# EasyEDA Pro project OPA847.eprj

# Schematic Schematic1
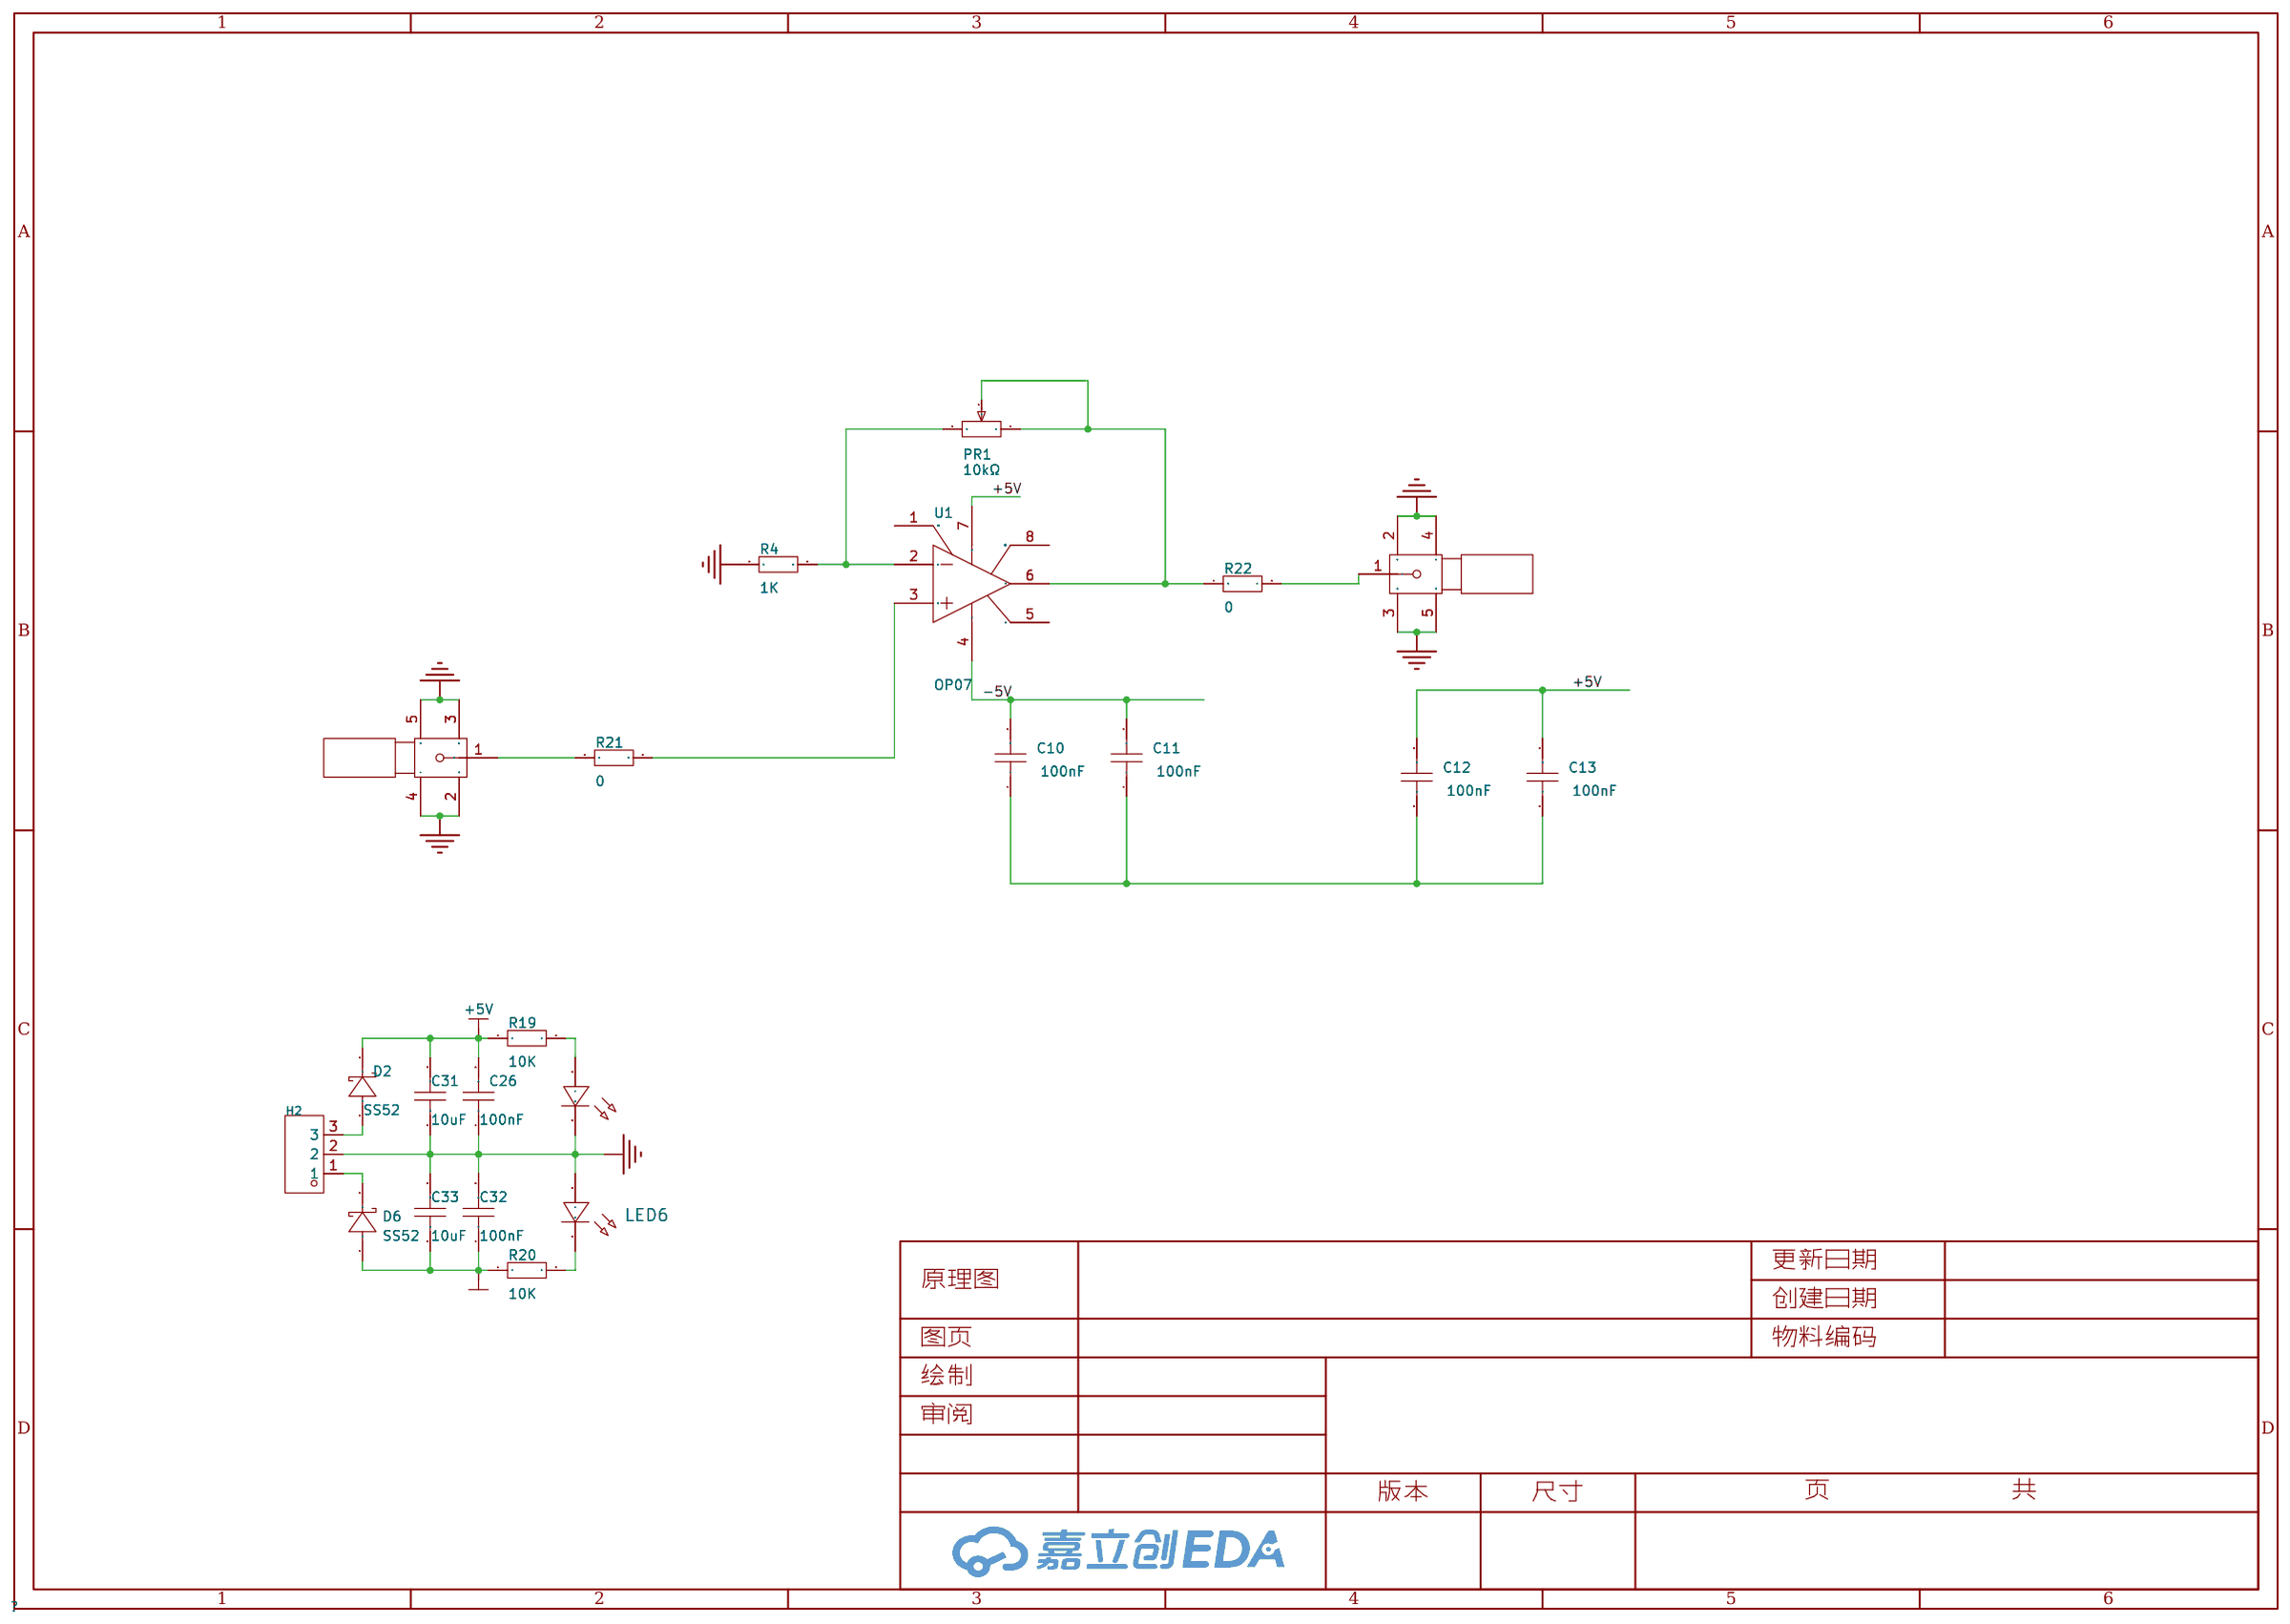
[diagram p0: schematic sheet]

## Parts
C10  100nF  [C0603]
C11  100nF  [C0603]
C12  100nF  [C0603]
C13  100nF  [C0603]
C26  100nF  [C0603]
C31  10uF  [C0603]
C32  100nF  [C0603]
C33  10uF  [C0603]
D2  SS52  [SMA_L4.3-W2.6-LS5.1-R-RD]
D6  SS52  [SMA_L4.3-W2.6-LS5.1-R-RD]
H2  -  [HDR-TH_3P-P2.54-V-F]
IN2  IN  [SMA-SMD_SMA-KE]
IN3  IN  [SMA-SMD_SMA-KE]
LED3  -  [LED_0603]
LED6  -  [LED_0603]
PR1  10kΩ  [R_3296]
R4  1K  [R0603]
R19  10K  [R0603]
R20  10K  [R0603]
R21  0  [R0603]
R22  0  [R0603]
U1  OP07  [SOP-8_L4.9-W3.9-P1.27-LS6.0-BL]

## Library data of the parts
C10-C13 C26 C31-C33 = CAP_0603: Supplier Footprint: 0603
D2 D6 = SS52: 二极管配置:独立式;正向压降(Vf):550mV@5A;直流反向耐压(Vr):20V;平均整流电流(Io):5A;; LCSC Part Name: 电压:20V 电流:5A; Supplier Part: C727064; Manufacturer: TWGMC(台湾迪嘉); Supplier Footprint: SMA(DO-214AC); JLCPCB Part Class: 扩展库; Datasheet: https://atta.szlcsc.com/upload/public/pdf/source/20200828/C727064_BD0A2B36CBC76CEA4B6710C57718D41F.pdf; Supplier: LCSC; Diode Configuration: 独立式; Forward Voltage (Vf@If): 550mV@5A; Reverse Voltage (Vr): 20V; Average Rectified Current (Io): 5A; Reverse Leakage Current (Ir): 500uA@20V
H2 = HDR-F_2.54_1x3P: Supplier Part: C541850; Supplier Footprint: 插件; Supplier: LCSC; Manufacturer: XFCN(兴飞); Manufacturer Part: PM254V-11-03-H85; JLCPCB Part Class: 扩展库
IN2 IN3 = SMA-KE_C9900004802: LCSC Part Name: SMA-KE; Supplier Part: C9900004802; Supplier Footprint: SMA-Hole-2Pin; JLCPCB Part Class: 扩展库; Supplier: LCSC
LED3 LED6 = LED_0603-R: Supplier Footprint: 0603
PR1 = R_3296: Supplier Footprint: 直插
R4 R19-R22 = Res_0603: Supplier Footprint: 0603
U1 = OP07: 放大器组数:-;; Supplier Part: C1508997; Manufacturer: 杭州瑞盟; Supplier Footprint: SOP-8; JLCPCB Part Class: 扩展库; Datasheet: https://atta.szlcsc.com/upload/public/pdf/source/20201221/C1508997_31DB1D3DFE7BEFB064DC1C62AA82E0AA.pdf; Supplier: LCSC

## Nets
+5V: C12.2 C13.2 C26.2 C31.2 D2.2(K) R19.1 U1.7(V+)
-5V: C10.2 C11.2 C32.1 C33.1 D6.1(A) R20.1 U1.4(V-)
GND: C10.1 C11.1 C12.1 C13.1 C26.1 C31.1 C32.2 C33.2 H2.2 IN2.2 IN2.3 IN2.4 IN2.5 IN3.2 IN3.3 IN3.4 IN3.5 LED3.1(C) LED6.2(A) R4.1
$1N559: R21.2 U1.3(IN+)
$1N560: IN2.1 R21.1
$1N564: PR1.3 R4.2 U1.2(IN-)
$1N1121: LED6.1(C) R20.2
$1N1122: D2.1(A) H2.3
$1N1124: D6.2(K) H2.1
$1N1126: LED3.2(A) R19.2
$1N1210: IN3.1 R22.2
$1N1216: PR1.1 PR1.2 R22.1 U1.6(OUT)

Not connected (* = marked no-connect by the designer): U1 1(VOS TRIM) 5(NC) 8(VOS TRIM)

# Board PCB1
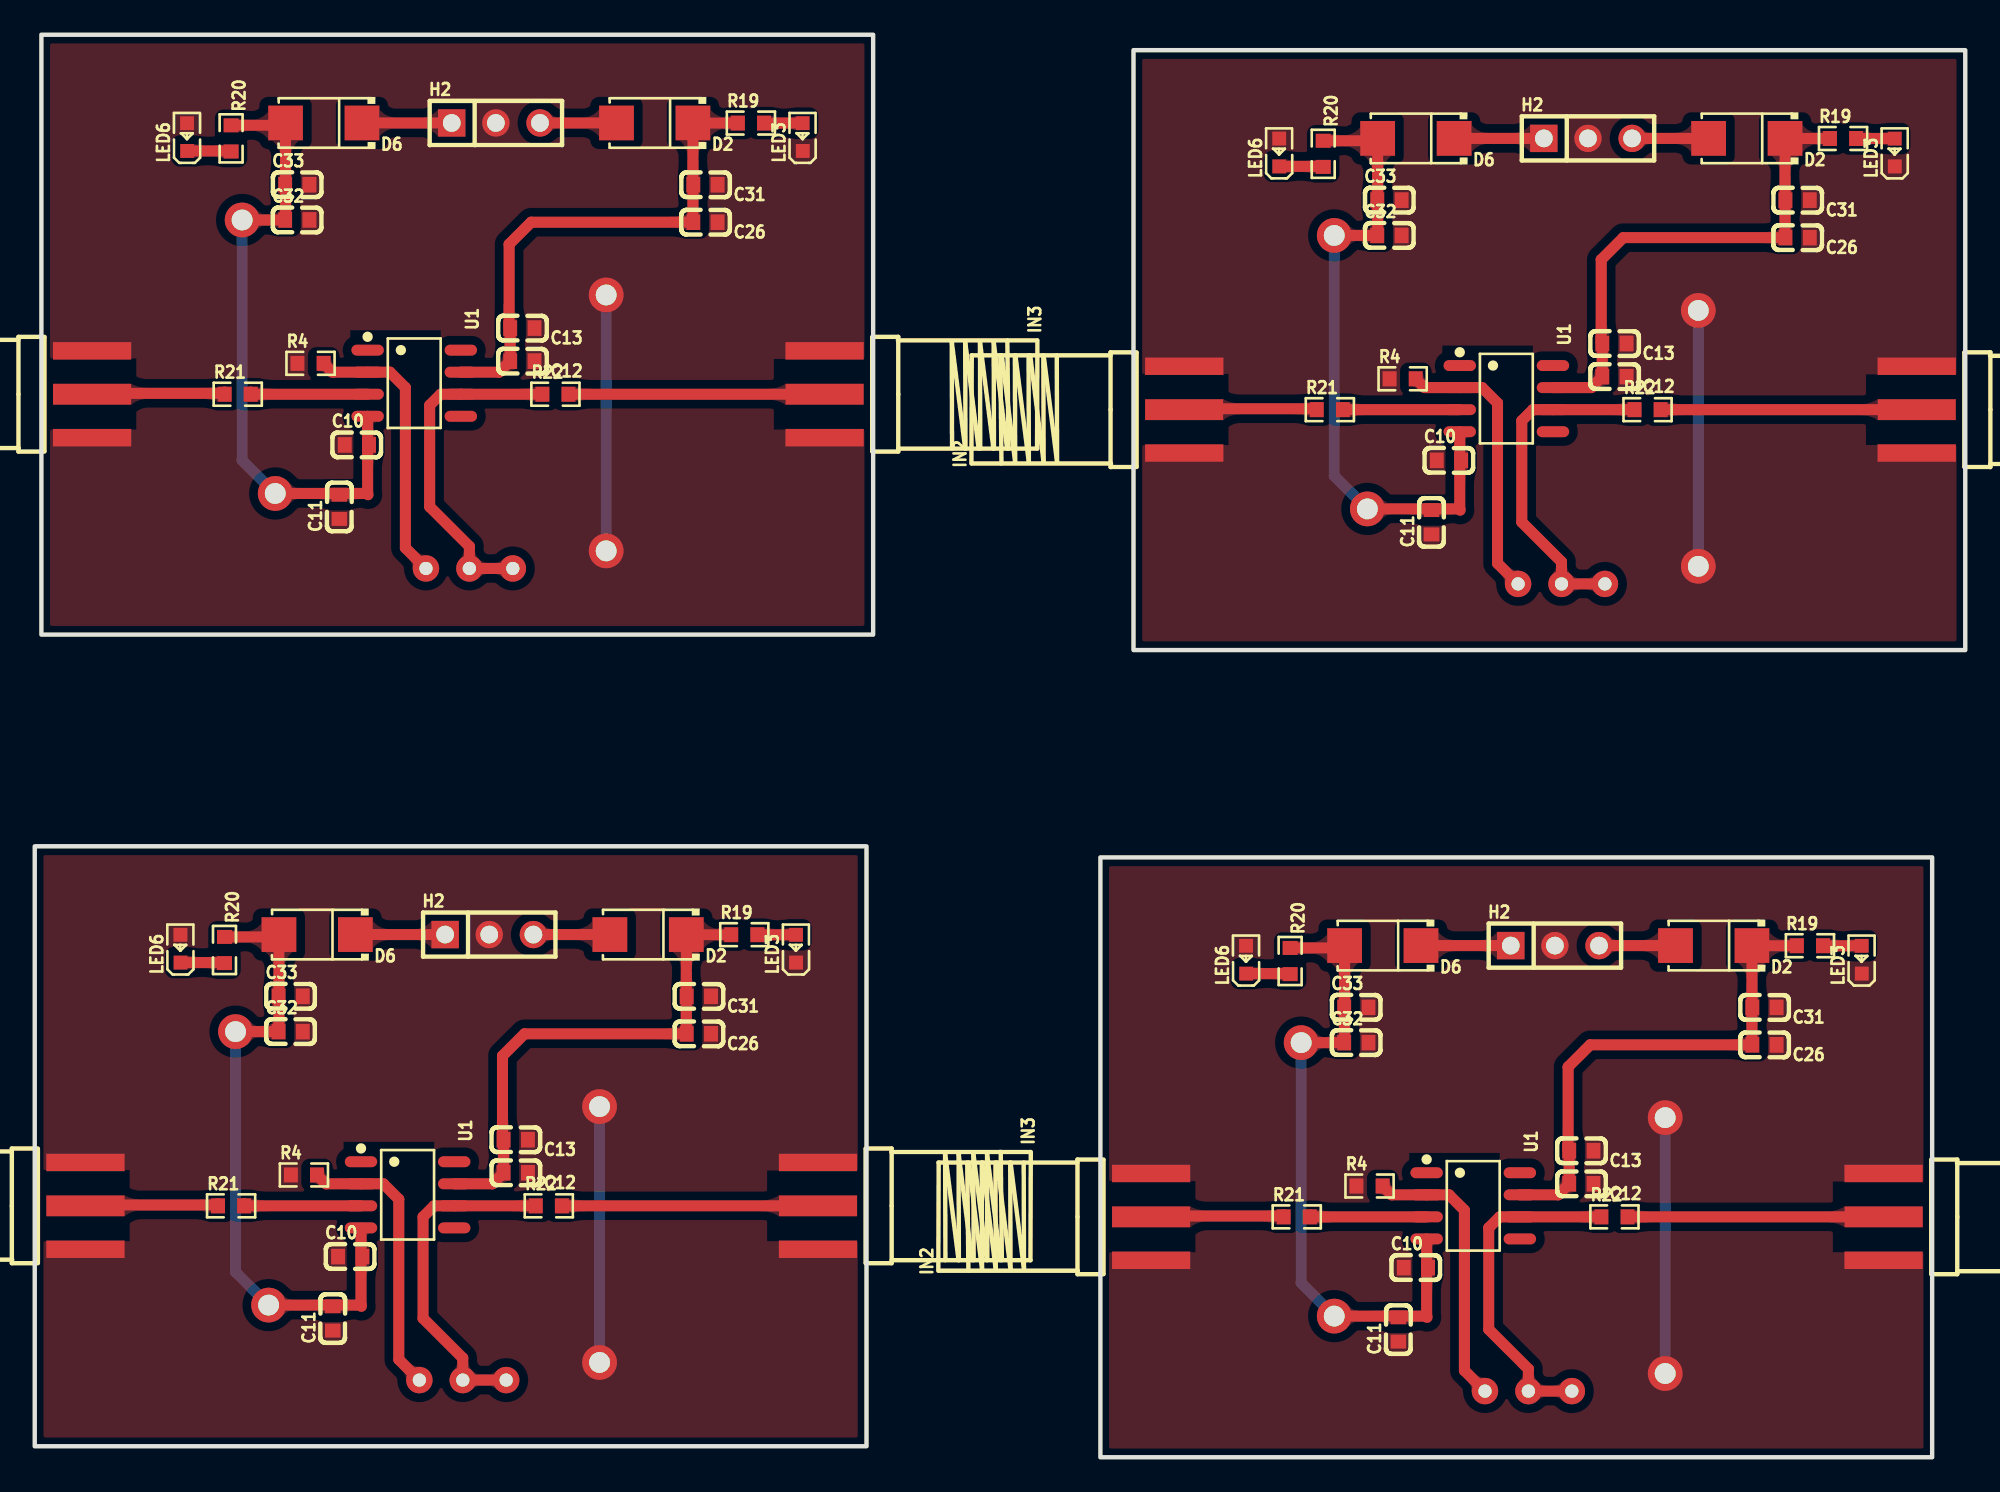
[diagram p1: board, top side]
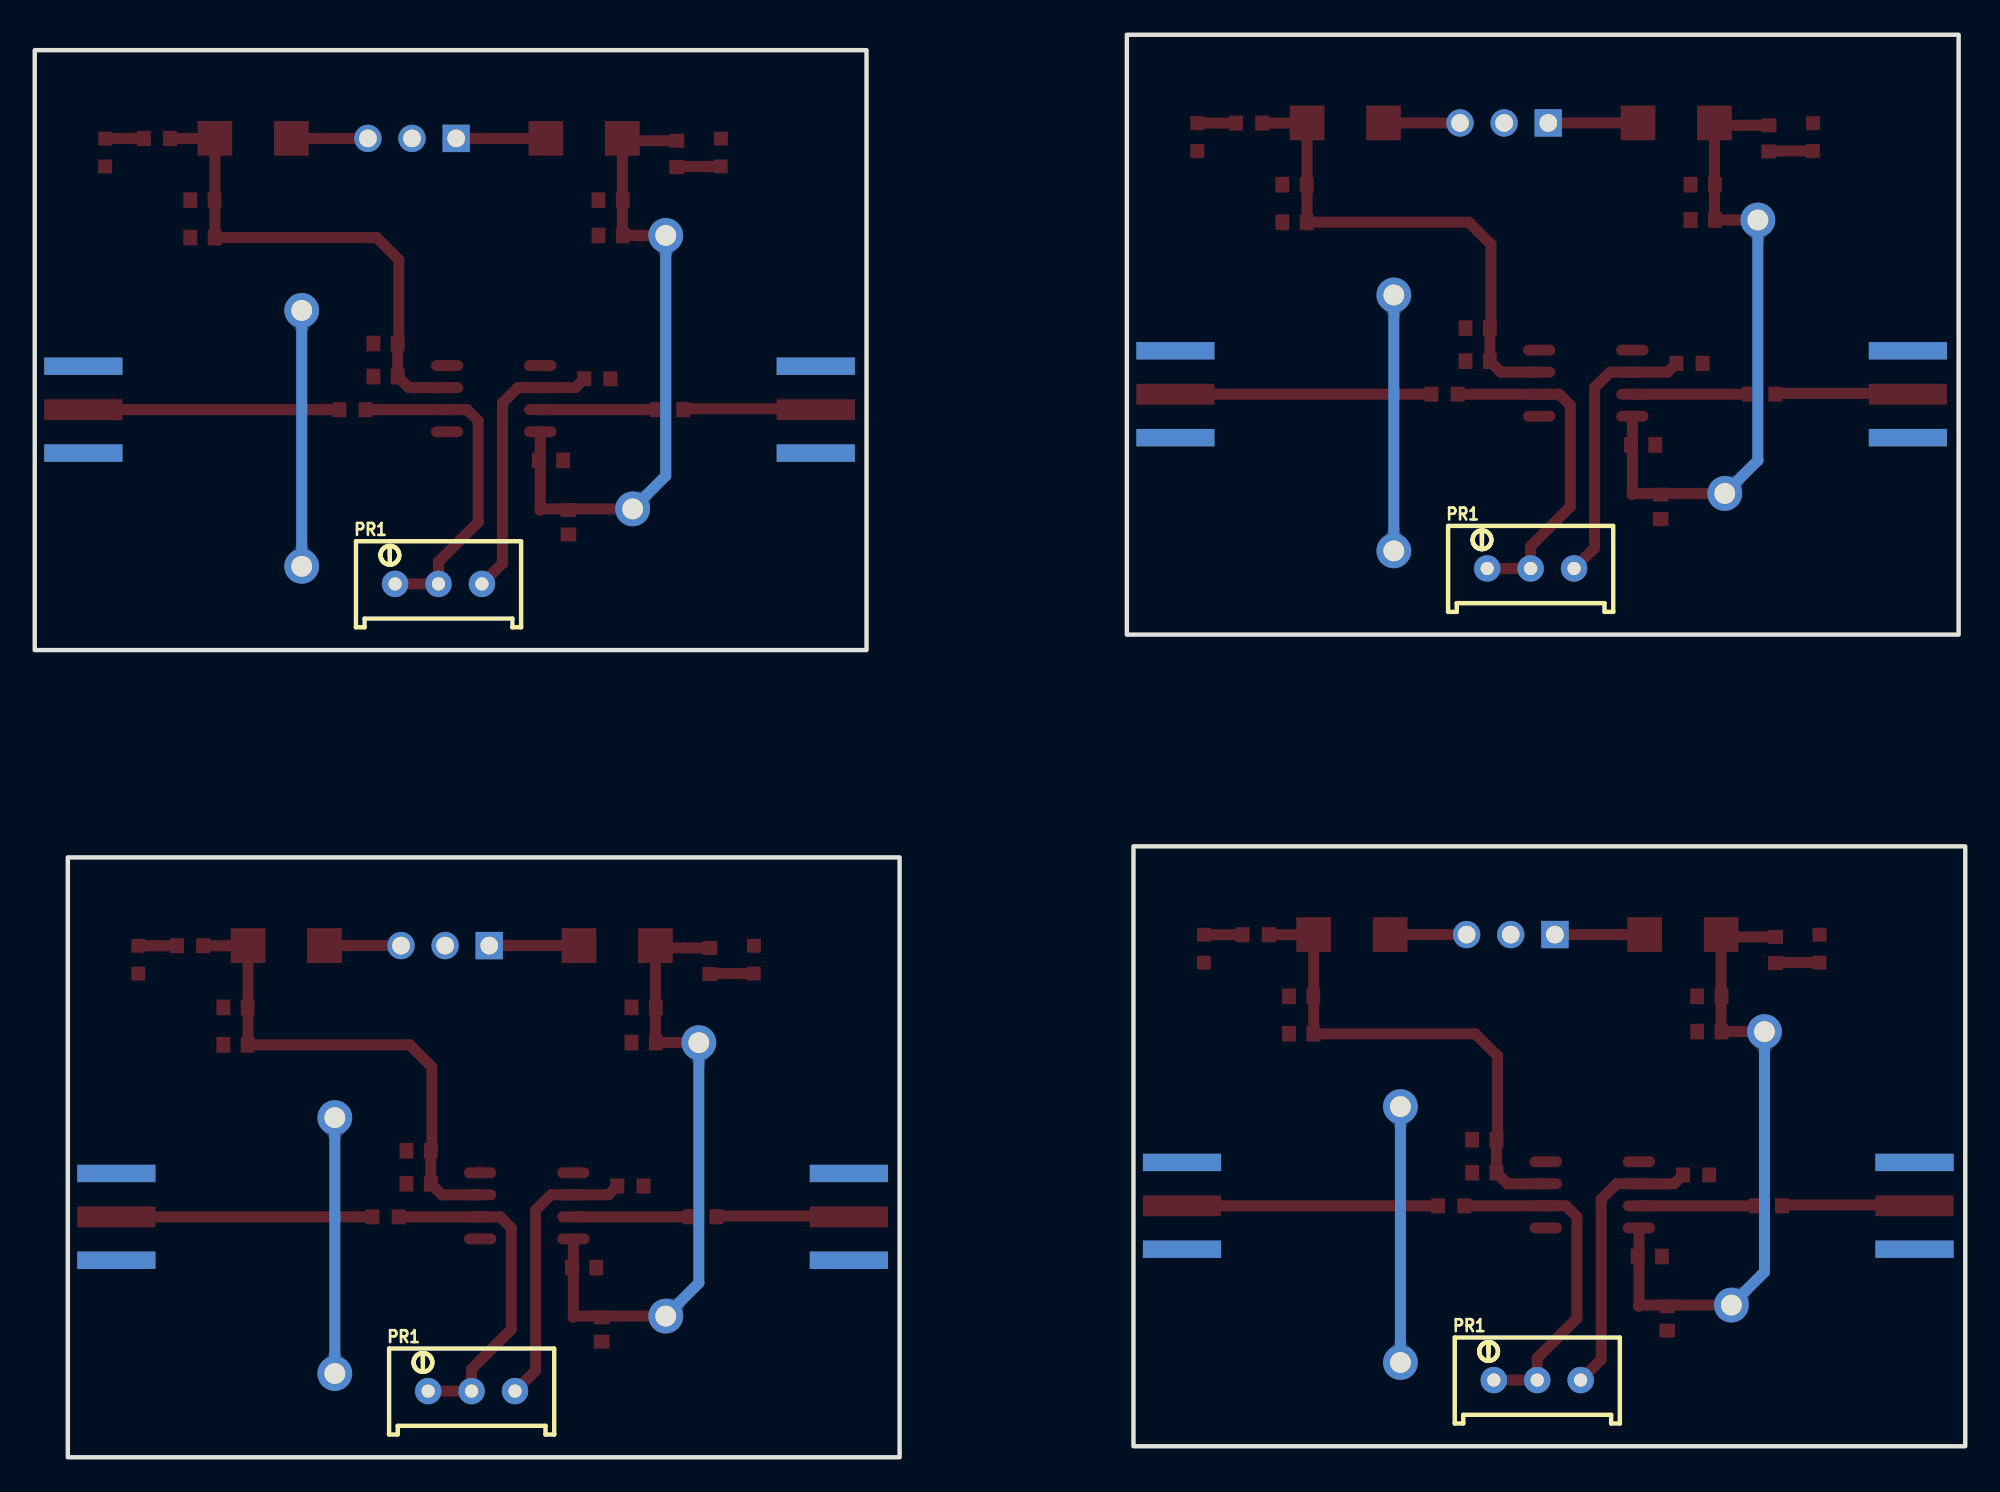
[diagram p2: board, bottom side, seen from below]

Outline 111.12 x 81.91 mm; copper layers: Top Layer, Bottom Layer. Coordinates in mm from the lower left corner of the outline.
Outline path: rectangle 0,35.18 47.88,0.63 ; rectangle 0.38,81.91 48.26,47.37 ; rectangle 61.34,34.54 109.22,0 ; rectangle 63.25,81.03 111.12,46.48
Stack: Top Layer 0.035mm / Dielectric1 1.51mm FR4 er 4.5 / Bottom Layer 0.035mm

## Design rules (mm)
template: 自定义配置
spacing copperThickness1oz (default): track to track 0.102, other pairs 0.152 to 0.3
spacing copperThickness2oz: track to track 0.203, other pairs 0.152 to 0.3
track width copperThickness1oz (default): min 0.127, default 0.254, max 2.54
track width copperThickness2oz: min 0.203, default 0.254, max 2.54
differential pair differentialPair (default): width min 0.127, default 0.254, max 2.54; gap min 0.152, default 0.152
via viaSize (default): diameter min 0.5, default 0.61, max 10; hole min 0.3, default 0.305, max 6.3

## Placement (name value [footprint] x y rotation side)
C10  100nF  [C0603]  81.41 57.4 0 top
C10#2  -  [C0603]  18.54 58.29 0 top
C10#3  -  [C0603]  18.16 11.56 0 top
C10#4  -  [C0603]  79.5 10.92 0 top
C11  100nF  [C0603]  17.54 54.73 90 top
C11#2  -  [C0603]  17.15 7.99 90 top
C11#3  -  [C0603]  80.4 53.84 90 top
C11#4  -  [C0603]  78.5 7.36 90 top
C12  100nF  [C0603]  28.07 63.12 180 top
C12#2  -  [C0603]  27.69 16.38 180 top
C12#3  -  [C0603]  90.93 62.23 180 top
C12#4  -  [C0603]  89.03 15.75 180 top
C13  100nF  [C0603]  28.07 65.02 180 top
C13#2  -  [C0603]  27.69 18.29 180 top
C13#3  -  [C0603]  90.93 64.13 180 top
C13#4  -  [C0603]  89.03 17.65 180 top
C26  100nF  [C0603]  38.23 24.38 180 top
C26#2  -  [C0603]  38.61 71.12 180 top
C26#3  -  [C0603]  101.47 70.23 180 top
C26#4  -  [C0603]  99.57 23.75 180 top
C31  10uF  [C0603]  38.23 26.54 180 top
C31#2  -  [C0603]  101.47 72.39 180 top
C31#3  -  [C0603]  99.57 25.91 180 top
C31#4  -  [C0603]  38.61 73.28 180 top
C32  100nF  [C0603]  14.73 24.51 0 top
C32#2  -  [C0603]  77.98 70.36 0 top
C32#3  -  [C0603]  76.07 23.88 0 top
C32#4  -  [C0603]  15.11 71.25 0 top
C33  10uF  [C0603]  14.73 26.54 0 top
C33#2  -  [C0603]  77.98 72.39 0 top
C33#3  -  [C0603]  76.07 25.91 0 top
C33#4  -  [C0603]  15.11 73.28 0 top
D2  SS52  [SMA_L4.3-W2.6-LS5.1-R-RD]  35.31 30.1 180 top
D2#2  -  [SMA_L4.3-W2.6-LS5.1-R-RD]  98.55 75.95 180 top
D2#3  -  [SMA_L4.3-W2.6-LS5.1-R-RD]  96.65 29.46 180 top
D2#4  -  [SMA_L4.3-W2.6-LS5.1-R-RD]  35.69 76.83 180 top
D6  SS52  [SMA_L4.3-W2.6-LS5.1-R-RD]  16.64 76.83 180 top
D6#2  -  [SMA_L4.3-W2.6-LS5.1-R-RD]  16.26 30.1 180 top
D6#3  -  [SMA_L4.3-W2.6-LS5.1-R-RD]  79.5 75.95 180 top
D6#4  -  [SMA_L4.3-W2.6-LS5.1-R-RD]  77.6 29.46 180 top
H2  -  [HDR-TH_3P-P2.54-V-F]  26.54 76.83 0 top
H2#2  -  [HDR-TH_3P-P2.54-V-F]  26.16 30.1 0 top
H2#3  -  [HDR-TH_3P-P2.54-V-F]  89.41 75.95 0 top
H2#4  -  [HDR-TH_3P-P2.54-V-F]  87.5 29.46 0 top
IN2  IN  [SMA-SMD_SMA-KE]  3.3 61.21 90 top
IN2#2  -  [SMA-SMD_SMA-KE]  2.92 14.48 90 top
IN2#3  -  [SMA-SMD_SMA-KE]  66.17 60.32 90 top
IN2#4  -  [SMA-SMD_SMA-KE]  64.26 13.84 90 top
IN3  IN  [SMA-SMD_SMA-KE]  45.47 61.21 270 top
IN3#2  -  [SMA-SMD_SMA-KE]  45.09 14.48 270 top
IN3#3  -  [SMA-SMD_SMA-KE]  108.33 60.32 270 top
IN3#4  -  [SMA-SMD_SMA-KE]  106.43 13.84 270 top
LED3  -  [LED_0603]  44.2 76.07 90 top
LED3#2  -  [LED_0603]  43.81 29.34 90 top
LED3#3  -  [LED_0603]  107.06 75.18 90 top
LED3#4  -  [LED_0603]  105.16 28.7 90 top
LED6  -  [LED_0603]  71.63 75.18 90 top
LED6#2  -  [LED_0603]  8.76 76.07 90 top
LED6#3  -  [LED_0603]  8.38 29.34 90 top
LED6#4  -  [LED_0603]  69.72 28.7 90 top
NOREF  -  [Pad_e502]  95.76 66.04 0 top
NOREF#2  -  [Pad_e577]  72.9 23.88 0 top
NOREF#3  -  [Pad_e579]  93.85 4.82 0 top
NOREF#4  -  [Pad_e499]  74.8 70.36 0 top
NOREF#5  -  [Pad_e197]  32.89 52.19 0 top
NOREF#6  -  [Pad_e580]  93.85 19.56 0 top
NOREF#7  -  [Pad_e501]  95.76 51.3 0 top
NOREF#8  -  [Pad_e196]  32.89 66.93 0 top
NOREF#9  -  [Pad_e500]  76.71 54.61 0 top
NOREF#10  -  [Pad_e423]  32.51 5.46 0 top
NOREF#11  -  [Pad_e91]  11.94 71.25 0 top
NOREF#12  -  [Pad_e578]  74.8 8.13 0 top
NOREF#13  -  [Pad_e421]  11.56 24.51 0 top
NOREF#14  -  [Pad_e424]  32.51 20.19 0 top
NOREF#15  -  [Pad_e422]  13.46 8.76 0 top
NOREF#16  -  [Pad_e102]  13.84 55.5 0 top
PR1  10kΩ  [R_3296]  25.02 51.31 180 bottom
PR1#2  -  [R_3296]  24.64 4.57 180 bottom
PR1#3  -  [R_3296]  87.88 50.42 180 bottom
PR1#4  -  [R_3296]  85.98 3.94 180 bottom
R4  1K  [R0603]  15.88 62.99 0 top
R4#2  -  [R0603]  15.49 16.26 0 top
R4#3  -  [R0603]  78.74 62.1 0 top
R4#4  -  [R0603]  76.84 15.62 0 top
R19  10K  [R0603]  41.22 76.83 0 top
R19#2  -  [R0603]  40.84 30.09 0 top
R19#3  -  [R0603]  104.09 75.94 0 top
R19#4  -  [R0603]  102.19 29.46 0 top
R20  10K  [R0603]  11.3 75.95 270 top
R20#2  -  [R0603]  10.92 29.21 270 top
R20#3  -  [R0603]  74.17 75.06 270 top
R20#4  -  [R0603]  72.26 28.57 270 top
R21  0  [R0603]  11.68 61.21 0 top
R21#2  -  [R0603]  11.3 14.48 0 top
R21#3  -  [R0603]  74.55 60.32 0 top
R21#4  -  [R0603]  72.64 13.84 0 top
R22  0  [R0603]  29.97 61.21 0 top
R22#2  -  [R0603]  29.59 14.48 0 top
R22#3  -  [R0603]  92.84 60.32 0 top
R22#4  -  [R0603]  90.93 13.84 0 top
U1  OP07  [SOP-8_L4.9-W3.9-P1.27-LS6.0-BL]  21.84 61.85 270 top
U1#2  -  [SOP-8_L4.9-W3.9-P1.27-LS6.0-BL]  21.46 15.11 270 top
U1#3  -  [SOP-8_L4.9-W3.9-P1.27-LS6.0-BL]  84.71 60.96 270 top
U1#4  -  [SOP-8_L4.9-W3.9-P1.27-LS6.0-BL]  82.8 14.48 270 top

## Footprints (pads in the part's own frame, mm; a bottom-side part is the same pattern mirrored in y, then rotated)
C0603
  rect 0.8x0.9 smd: 1(-0.7,0) 2(0.7,0)
HDR-TH_3P-P2.54-V-F
  rect 1.575x1.575 hole 1.02: 1(-2.54,0)
  round 1.575 hole 1.02: 2(0,0) 3(2.54,0)
LED_0603
  rect 0.8x0.8 smd: 1(-0.851,-0.01) 2(0.75,-0.005)
Pad_e91
  round 2 hole 1.2: 1(0,0)
Pad_e102
  round 2 hole 1.2: 1(0,0)
Pad_e196
  round 2 hole 1.2: 1(0,0)
Pad_e197
  round 2 hole 1.2: 2(0,0)
Pad_e421
  round 2 hole 1.2: 1(0,0)
Pad_e422
  round 2 hole 1.2: 1(0,0)
Pad_e423
  round 2 hole 1.2: 2(0,0)
Pad_e424
  round 2 hole 1.2: 1(0,0)
Pad_e499
  round 2 hole 1.2: 1(0,0)
Pad_e500
  round 2 hole 1.2: 1(0,0)
Pad_e501
  round 2 hole 1.2: 2(0,0)
Pad_e502
  round 2 hole 1.2: 1(0,0)
Pad_e577
  round 2 hole 1.2: 1(0,0)
Pad_e578
  round 2 hole 1.2: 1(0,0)
Pad_e579
  round 2 hole 1.2: 2(0,0)
Pad_e580
  round 2 hole 1.2: 1(0,0)
R0603
  rect 0.806x0.864 smd: 1(-0.753,0) 2(0.753,0)
R_3296
  round 1.524 hole 0.762: 1(-2.499,-0.127) 2(0,-0.127) 3(2.499,-0.127)
SMA-SMD_SMA-KE
  rect 1.2x4.5 smd: 1(0,0)
  rect 1x4.5 smd: 2(-2.5,0) 3(2.5,0)
  rect 1x4.5 smd far side: 4(-2.5,0) 5(2.5,0)
SMA_L4.3-W2.6-LS5.1-R-RD
  rect 2x2 smd: 1(2.2,0) 2(-2.2,0)
SOP-8_L4.9-W3.9-P1.27-LS6.0-BL
  oval 0.63x1.865 smd: 1(-1.905,-2.683) 2(-0.635,-2.683) 3(0.635,-2.683) 4(1.905,-2.683) 5(1.905,2.683) 6(0.635,2.683) 7(-0.635,2.683) 8(-1.905,2.683)

## Nets
+5V: C12.2 C12#2.2 C12#3.2 C12#4.2 C13.2 C13#2.2 C13#3.2 C13#4.2 C26.2 C26#2.2 C26#3.2 C26#4.2 C31.2 C31#2.2 C31#3.2 C31#4.2 D2.2 D2#2.2 D2#3.2 D2#4.2 R19.1 R19#2.1 R19#3.1 R19#4.1 U1.7 U1#2.7 U1#3.7 U1#4.7
-5V: C10.2 C10#2.2 C10#3.2 C10#4.2 C11.2 C11#2.2 C11#3.2 C11#4.2 C32.1 C32#2.1 C32#3.1 C32#4.1 C33.1 C33#2.1 C33#3.1 C33#4.1 D6.1 D6#2.1 D6#3.1 D6#4.1 NOREF#2.1 NOREF#4.1 NOREF#9.1 NOREF#11.1 NOREF#12.1 NOREF#13.1 NOREF#15.1 NOREF#16.1 R20.1 R20#2.1 R20#3.1 R20#4.1 U1.4 U1#2.4 U1#3.4 U1#4.4
GND: C10.1 C10#2.1 C10#3.1 C10#4.1 C11.1 C11#2.1 C11#3.1 C11#4.1 C12.1 C12#2.1 C12#3.1 C12#4.1 C13.1 C13#2.1 C13#3.1 C13#4.1 C26.1 C26#2.1 C26#3.1 C26#4.1 C31.1 C31#2.1 C31#3.1 C31#4.1 C32.2 C32#2.2 C32#3.2 C32#4.2 C33.2 C33#2.2 C33#3.2 C33#4.2 H2.2 H2#2.2 H2#3.2 H2#4.2 IN2.2 IN2.3 IN2.4 IN2.5 IN2#2.2 IN2#2.3 IN2#2.4 IN2#2.5 IN2#3.2 IN2#3.3 IN2#3.4 IN2#3.5 IN2#4.2 IN2#4.3 IN2#4.4 IN2#4.5 IN3.2 IN3.3 IN3.4 IN3.5 IN3#2.2 IN3#2.3 IN3#2.4 IN3#2.5 IN3#3.2 IN3#3.3 IN3#3.4 IN3#3.5 IN3#4.2 IN3#4.3 IN3#4.4 IN3#4.5 LED3.1 LED3#2.1 LED3#3.1 LED3#4.1 LED6.2 LED6#2.2 LED6#3.2 LED6#4.2 NOREF.1 NOREF#3.2 NOREF#5.2 NOREF#6.1 NOREF#7.2 NOREF#8.1 NOREF#10.2 NOREF#14.1 R4.1 R4#2.1 R4#3.1 R4#4.1
$1N559: R21.2 R21#2.2 R21#3.2 R21#4.2 U1.3 U1#2.3 U1#3.3 U1#4.3
$1N560: IN2.1 IN2#2.1 IN2#3.1 IN2#4.1 R21.1 R21#2.1 R21#3.1 R21#4.1
$1N564: PR1.3 PR1#2.3 PR1#3.3 PR1#4.3 R4.2 R4#2.2 R4#3.2 R4#4.2 U1.2 U1#2.2 U1#3.2 U1#4.2
$1N1121: LED6.1 LED6#2.1 LED6#3.1 LED6#4.1 R20.2 R20#2.2 R20#3.2 R20#4.2
$1N1122: D2.1 D2#2.1 D2#3.1 D2#4.1 H2.3 H2#2.3 H2#3.3 H2#4.3
$1N1124: D6.2 D6#2.2 D6#3.2 D6#4.2 H2.1 H2#2.1 H2#3.1 H2#4.1
$1N1126: LED3.2 LED3#2.2 LED3#3.2 LED3#4.2 R19.2 R19#2.2 R19#3.2 R19#4.2
$1N1210: IN3.1 IN3#2.1 IN3#3.1 IN3#4.1 R22.2 R22#2.2 R22#3.2 R22#4.2
$1N1216: PR1.1 PR1.2 PR1#2.1 PR1#2.2 PR1#3.1 PR1#3.2 PR1#4.1 PR1#4.2 R22.1 R22#2.1 R22#3.1 R22#4.1 U1.6 U1#2.6 U1#3.6 U1#4.6

Pads without a net: U1 1 5 8; U1#2 1 5 8; U1#3 1 5 8; U1#4 1 5 8

## Routing (per net, layer and track width the routed paths; a pad name or vN(x,y) marks a point on that pad's centre or on a via; arc(x,y) is an arc through that point)
+5V: length 117.2
  Top Layer w0.635: R19#3.1 100.76,75.94 D2#2.2 100.75,70.25 C26#3.2 91.44,70.23 90.17,68.96 90.17,64.2 C13#3.2 C12#3.2 89.6,61.59 87.39,61.59 ; R19.1 37.89,76.83 D2#4.2 37.89,71.14 C26#2.2 28.58,71.12 27.31,69.85 27.31,65.09 C13.2 C12.2 26.73,62.48 U1.7 ; R19#4.1 98.85,29.46 D2#3.2 98.85,23.77 98.87,23.75 89.53,23.75 88.27,22.48 88.27,17.72 C13#4.2 C12#4.2 87.69,15.11 85.49,15.11 ; U1#2.7 26.35,15.75 C12#2.2 C13#2.2 26.92,18.35 26.92,23.11 28.19,24.38 C26.2 37.51,24.4 D2.2 37.51,30.09 R19#2.1
-5V: length 150.5
  Top Layer w0.635: R20.1 14.3,76.7 D6.1 14.44,71.27 C32#4.1 NOREF#11.1 ; 18.73,8.76 18.78,8.81 U1#2.4 ; 18.73,8.76 18.8,8.69 ; 18.73,8.76 NOREF#15.1 ; 80.07,8.13 80.14,8.06 ; 80.07,8.13 NOREF#12.1 ; 80.07,8.13 80.12,8.18 U1#4.4 ; R20#3.1 77.17,75.81 D6#3.1 77.3,70.38 C32#2.1 NOREF#4.1 ; U1.4 19.16,55.55 19.11,55.5 ; 19.11,55.5 19.18,55.43 ; 19.11,55.5 NOREF#16.1 ; 81.98,54.61 82.03,54.66 U1#3.4 ; 81.98,54.61 82.05,54.54 ; 81.98,54.61 NOREF#9.1 ; NOREF#2.1 C32#3.1 75.4,23.9 D6#4.1 75.26,29.33 R20#4.1 ; NOREF#13.1 C32.1 14.06,24.53 D6#2.1 13.92,29.96 R20#2.1
  Bottom Layer w0.635: NOREF#12.1 72.9,10.03 NOREF#2.1 ; NOREF#13.1 11.56,10.67 NOREF#15.1 ; NOREF#4.1 74.8,56.51 NOREF#9.1 ; NOREF#16.1 11.94,57.4 NOREF#11.1
GND: length 58.9
  Bottom Layer w0.635: NOREF.1 NOREF#7.2 ; NOREF#8.1 NOREF#5.2 ; NOREF#6.1 NOREF#3.2 ; NOREF#14.1 NOREF#10.2
$1N559: length 27.1
  Top Layer w0.635: 75.3,60.45 75.43,60.32 U1#3.3 ; 73.4,13.97 73.52,13.84 U1#4.3 ; U1.3 12.56,61.21 12.44,61.34 ; 12.06,14.6 12.18,14.48 U1#2.3
$1N560: length 29.7
  Top Layer w0.635: 66.42,60.45 66.5,60.38 73.72,60.38 73.8,60.45 ; 71.89,13.97 71.81,13.89 64.59,13.89 64.52,13.97 ; 3.17,14.6 3.25,14.53 10.47,14.53 10.55,14.6 ; 3.56,61.34 3.63,61.26 10.85,61.26 10.93,61.34
$1N564: length 64.8
  Top Layer w0.635: R4#4.2 78.1,15.11 81.41,15.11 82.3,14.22 82.3,4.99 PR1#4.3 ; PR1.3 21.34,52.36 21.34,61.59 20.45,62.48 U1.2 17.14,62.48 R4.2 ; PR1#3.3 84.2,51.48 84.2,60.71 83.31,61.59 80,61.59 R4#3.2 ; R4#2.2 16.76,15.75 U1#2.2 20.07,15.75 20.95,14.86 20.95,5.63 PR1#2.3
$1N1121: length 10.2
  Top Layer w0.635: 8.39,28.49 10.89,28.49 R20#2.2 ; R20#3.2 74.14,74.33 LED6.1 ; R20#4.2 72.23,27.85 LED6#4.1 ; LED6#2.1 11.27,75.22 R20.2
$1N1122: length 17.6
  Top Layer w0.635: H2#2.3 D2.1 ; H2#3.3 D2#2.1 ; H2.3 D2#4.1 ; H2#4.3 D2#3.1
$1N1124: length 20.7
  Top Layer w0.635: D6.2 H2.1 ; D6#4.2 H2#4.1 ; D6#3.2 H2#3.1 ; D6#2.2 H2#2.1
$1N1126: length 8.9
  Top Layer w0.635: R19#2.2 43.81,30.09 LED3#2.2 ; R19.2 44.2,76.83 LED3.2 ; R19#4.2 105.16,29.46 LED3#4.2 ; LED3#3.2 107.06,75.94 R19#3.2
$1N1210: length 59
  Top Layer w0.635: IN3.1 R22.2 ; IN3#3.1 R22#3.2 ; IN3#4.1 R22#4.2 ; IN3#2.1 R22#2.2
$1N1216: length 78.4
  Top Layer w0.635: R22#2.1 U1#2.6 22.99,14.48 22.35,13.84 22.35,8 24.64,5.72 PR1#2.2 PR1#2.1 ; PR1.1 PR1.2 25.02,52.45 22.73,54.74 22.73,60.58 23.37,61.21 U1.6 R22.1 ; R22#4.1 U1#4.6 84.33,13.84 83.69,13.21 83.69,7.37 85.98,5.08 PR1#4.2 PR1#4.1 ; PR1#3.1 PR1#3.2 87.88,51.56 85.6,53.85 85.6,59.69 86.23,60.32 U1#3.6 R22#3.1

## Copper pours and planes (outline as drawn; the poured copper is in the pictures)
GND on Top Layer: -19.56,102.23 151.64,102.23 161.42,92.46 161.42,10.29 131.57,-19.56 -9.27,-19.56 -12.57,-16.26 -12.57,95.25

Small or netless copper shapes (teardrops, artwork), in the pictures only: 176 on Top Layer, 16 on Bottom Layer
